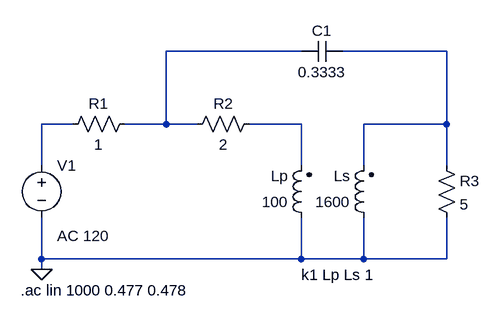
[diagram p0: schematic Task4.asc]
Task4.asc, the LTspice schematic file:
Version 4
SHEET 1 880 680
WIRE 528 -16 320 -16
WIRE 752 -16 592 -16
WIRE 176 96 128 96
WIRE 320 96 320 -16
WIRE 320 96 256 96
WIRE 368 96 320 96
WIRE 528 96 448 96
WIRE 752 96 752 -16
WIRE 752 96 624 96
WIRE 128 160 128 96
WIRE 528 160 528 96
WIRE 624 160 624 96
WIRE 752 160 752 96
WIRE 128 304 128 240
WIRE 528 304 528 240
WIRE 528 304 128 304
WIRE 624 304 624 240
WIRE 624 304 528 304
WIRE 752 304 752 240
WIRE 752 304 624 304
WIRE 128 320 128 304
FLAG 128 320 0
SYMBOL voltage 128 144 R0
WINDOW 123 24 124 Left 2
WINDOW 39 0 0 Left 0
SYMATTR Value2 AC 120
SYMATTR InstName V1
SYMATTR Value ""
SYMBOL res 160 112 R270
WINDOW 0 32 56 VTop 2
WINDOW 3 0 56 VBottom 2
SYMATTR InstName R1
SYMATTR Value 1
SYMBOL res 464 80 R90
WINDOW 0 0 56 VBottom 2
WINDOW 3 32 56 VTop 2
SYMATTR InstName R2
SYMATTR Value 2
SYMBOL ind2 544 256 R180
WINDOW 0 36 80 Left 2
WINDOW 3 36 40 Left 2
SYMATTR InstName Lp
SYMATTR Value 100
SYMBOL ind2 640 256 R180
WINDOW 0 36 80 Left 2
WINDOW 3 36 40 Left 2
SYMATTR InstName Ls
SYMATTR Value 1600
SYMBOL res 736 144 R0
SYMATTR InstName R3
SYMATTR Value 5
SYMBOL cap 528 0 R270
WINDOW 0 32 32 VTop 2
WINDOW 3 0 32 VBottom 2
SYMATTR InstName C1
SYMATTR Value 0.3333
TEXT 528 328 Left 2 !k1 Lp Ls 1
TEXT 96 352 Left 2 !.ac lin 1000 0.477 0.478

The netlist it stands for:
* Task4.asc
V1 N003 0 AC 120
R1 N003 N001 1
R2 N004 N001 2
Lp 0 N004 100
Ls 0 N002 1600
R3 N002 0 5
C1 N001 N002 0.3333
k1 Lp Ls 1
.ac lin 1000 0.477 0.478
.backanno
.end